# Altium schematic sheet doan2.SchDoc
size A4; SheetNumber: 1; SheetTotal: 3
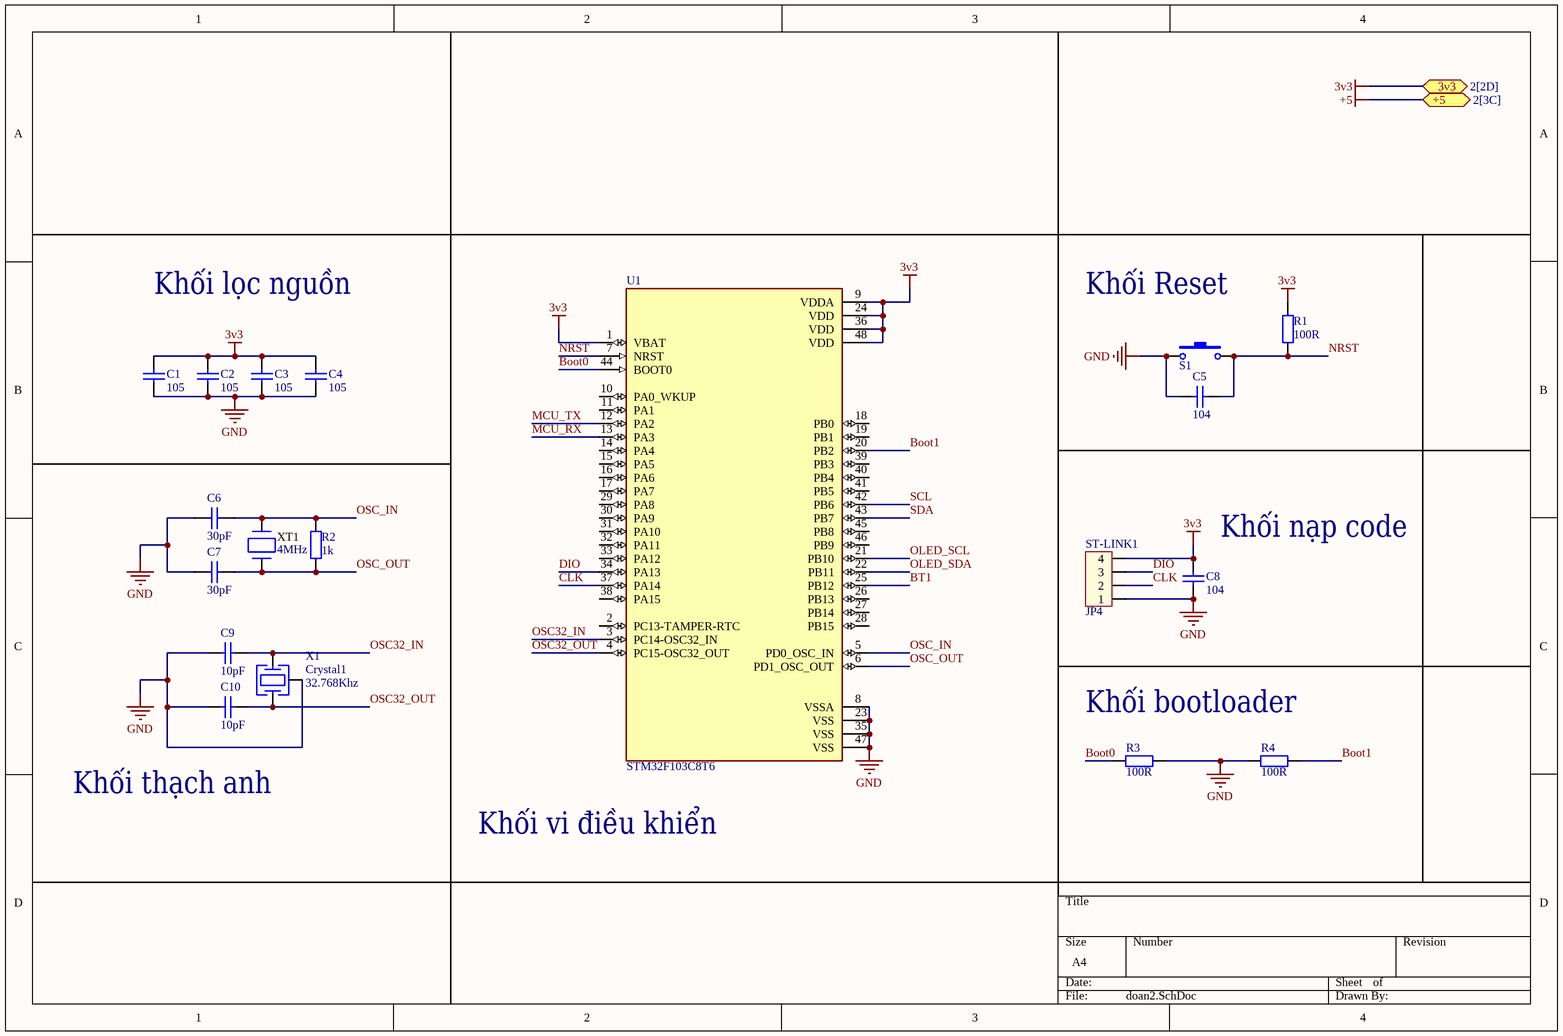
[diagram p0: doan2.SchDoc]

## Parts
C1  value 105  [C-NP-0805]  (hidden comment: Cap Non-pol)
C2  value 105  [C-NP-0805]  (hidden comment: Cap Non-pol)
C3  value 105  [C-NP-0805]  (hidden comment: Cap Non-pol)
C4  value 105  [C-NP-0805]  (hidden comment: Cap Non-pol)
C5  value 104  [C-NP-0805]  (hidden comment: Cap Non-pol)
C6  value 30pF  [C-NP-0805]  (hidden comment: Cap Non-pol)
C7  value 30pF  [C-NP-0805]  (hidden comment: Cap Non-pol)
C8  value 104  [C-NP-0805]  (hidden comment: Cap Non-pol)
C9  value 10pF  [C-NP-0805]  (hidden comment: Cap Non-pol)
C10  value 10pF  [C-NP-0805]  (hidden comment: Cap Non-pol)
R1  value 100R  [DIEN TRO 0805]  (hidden comment: RES_SMD_0805)
R2  value 1k  [DIEN TRO 0805]  (hidden comment: RES_SMD_0805)
R3  value 100R  [DIEN TRO 0805]  (hidden comment: RES_SMD_0805)
R4  value 100R  [DIEN TRO 0805]  (hidden comment: RES_SMD_0805)
S1  SW-SMD  [SW-SMD]  (value not drawn)
ST-LINK1  JP4  [CON4]
U1  STM32F103C8T6  [QFP50P900X900X160-48N]
X1  Crystal1  value 32.768Khz  [Crystal cylinder]
XT1  value 4MHz  [Crystal.HC49/USxx]  (hidden comment: Crystal2)

## Ports
3v3 (bidir, see 2[2D]), +5 (bidir, see 2[3C])

## Nets
3v3: C1.2 C2.2 C3.2 C4.2 C8.1 R1.2 ST-LINK1.4 U1.1(VBAT) U1.9(VDDA) U1.24(VDD) U1.36(VDD) U1.48(VDD) ; port 3v3
+5: port +5
GND: C1.1 C2.1 C3.1 C4.1 C5.2 C6.2 C7.2 C8.2 C9.2 C10.2 R3.2 R4.1 S1.1 ST-LINK1.1 U1.8(VSSA) U1.23(VSS) U1.35(VSS) U1.47(VSS) X1.3(GND)
Boot0: R3.1 U1.44(BOOT0)
Boot1: R4.2 U1.20(PB2)
BT1: U1.25(PB12)
CLK: ST-LINK1.2 U1.37(PA14)
DIO: ST-LINK1.3 U1.34(PA13)
MCU_RX: U1.13(PA3)
MCU_TX: U1.12(PA2)
NRST: C5.1 R1.1 S1.2 U1.7(NRST)
OLED_SCL: U1.21(PB10)
OLED_SDA: U1.22(PB11)
OSC32_IN: C9.1 U1.3(PC14-OSC32_IN) X1.2
OSC32_OUT: C10.1 U1.4(PC15-OSC32_OUT) X1.1
OSC_IN: C6.1 R2.2 U1.5(PD0_OSC_IN) XT1.2
OSC_OUT: C7.1 R2.1 U1.6(PD1_OSC_OUT) XT1.1
SCL: U1.42(PB6)
SDA: U1.43(PB7)

Not connected (* = marked no-connect by the designer): U1 2(PC13-TAMPER-RTC) 10(PA0_WKUP) 11(PA1) 14(PA4) 15(PA5) 16(PA6) 17(PA7) 18(PB0) 19(PB1) 26(PB13) 27(PB14) 28(PB15) 29(PA8) 30(PA9) 31(PA10) 32(PA11) 33(PA12) 38(PA15) 39(PB3) 40(PB4) 41(PB5) 45(PB8) 46(PB9)

## Notes on the sheet
- Khối lọc nguồn
- Khối Reset
- (near C8) Khối nạp code
- Khối bootloader
- Khối thạch anh
- Khối vi điều khiển

## Library data of the parts
C1-C10 = Cap Non-pol: Non-polarized Capacitor; Published: 8-Jun-2000; LatestRevisionDate: 17-Jul-2002; LatestRevisionNote: Re-released for DXP Platform.; PackageReference: RAD-0.3; Publisher: Altium Limited
R1-R4 = RES_SMD_0805: RES_0805; Published: 8-Jun-2000; LatestRevisionDate: 17-Jul-2002; LatestRevisionNote: Re-released for DXP Platform.; PackageReference: AXIAL-0.4; Publisher: Altium Limited
S1 = SW-SMD: Switch; Published: 24-Mar-1999; LatestRevisionDate: 17-Jul-2002; LatestRevisionNote: Re-released for DXP Platform.; PackageReference: SPST-2; Publisher: Altium Limited
ST-LINK1 = Con4: Connector 4; Value: Connector 4
U1 = STM32F103C8T6: ARM® Cortex®-M3 STM32F1 Microcontroller IC 32-Bit 72MHz 64KB (64K x 8) FLASH 48-LQFP (7x7); MF: STMicroelectronics; SnapEDA_Link: https://www.snapeda.com/parts/STM32F103C8T6/STMicroelectronics/view-part/?ref=snap; Package: LQFP-48 STMicroelectronics; Value: *; MP: STM32F103C8T6; Check_prices: https://www.snapeda.com/parts/STM32F103C8T6/STMicroelectronics/view-part/?ref=eda
X1 = Crystal1: Tuning Forl Crystal Units (SMD-Cylinder Type); Vendor: Digikey; ComponentLink1URL: http://search.digikey.com/scripts/DkSearch/dksus.dll?Detail&name=300-2066-1-ND; ComponentLink1Description: Digikey Part Link; ComponentLink2URL: H:\LIBRARY\LIBRARY.Datasheet\k-cmr.pdf; ComponentLink2Description: Open Datasheet; Publisher: Hoang Nguyen; Published: 13-April-2009
XT1 = Crystal2: Quarz Crystal; Vendor: Digikey; Published: 13-April-2009; Publisher: Hoang Nguyen; ComponentLink1Description: Digikey Part Link; ComponentLink2Description: Open Datasheet; ComponentLink2URL: H:\LIBRARY\LIBRARY.Datasheet\; Price: 2000 VND